# Altium schematic sheet suply_1w.SchDoc
size A4
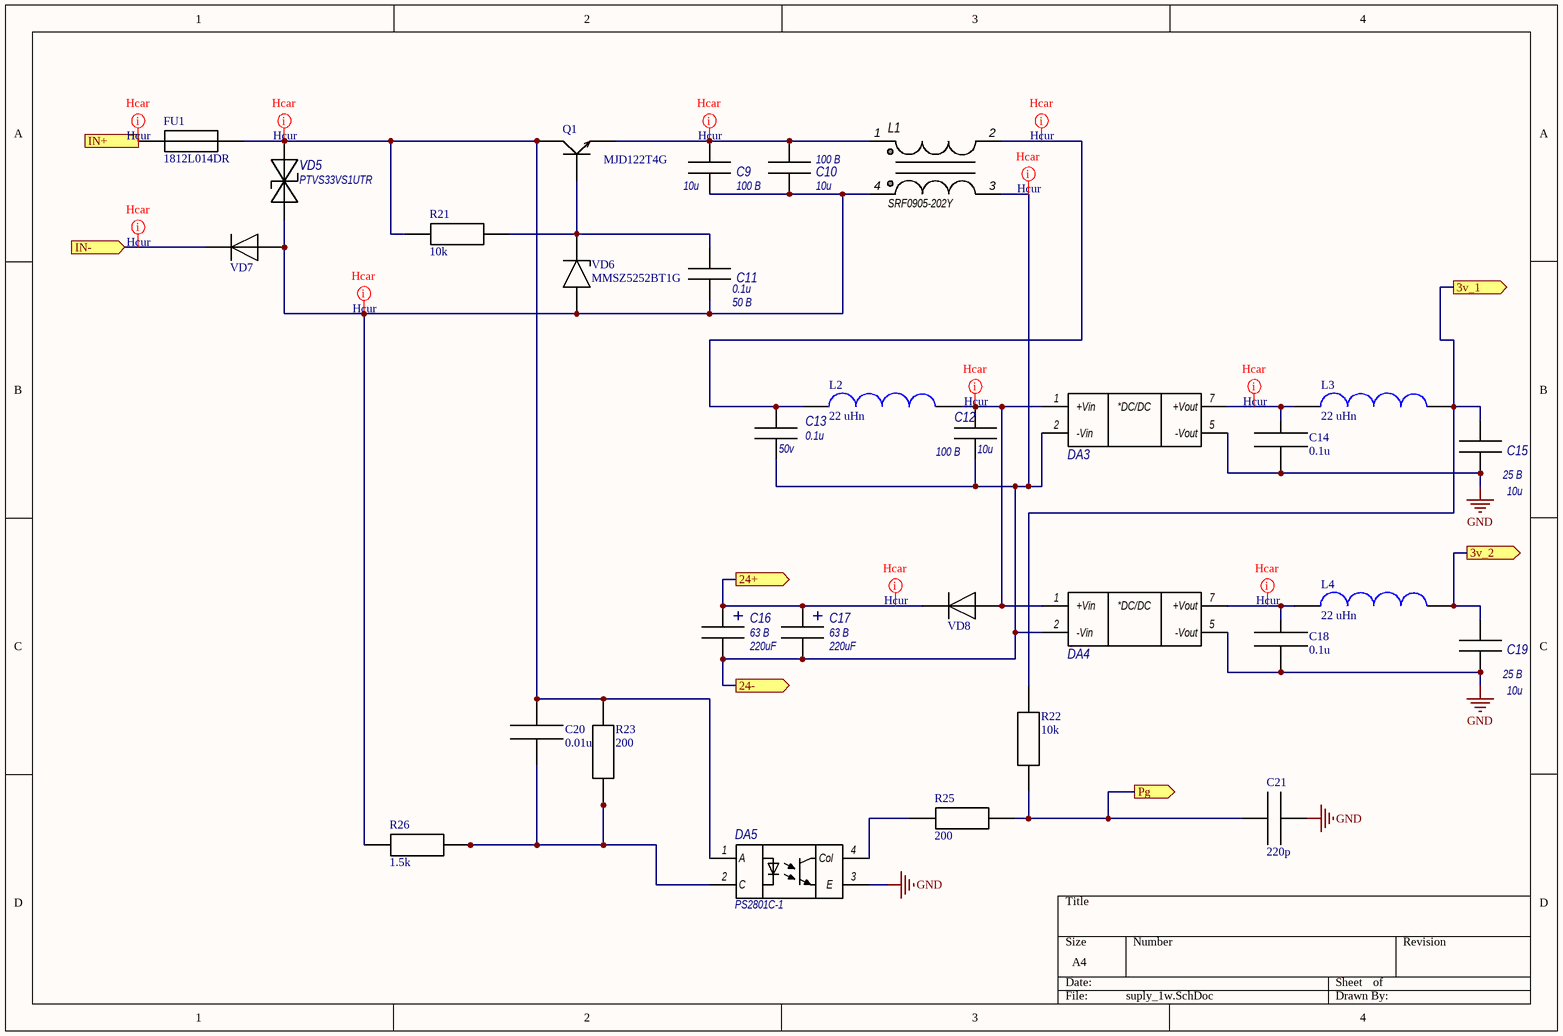
[diagram p0: suply_1w.SchDoc]

## Parts
C9  value 10u  Voltage: 100 В  [C1206_]  (hidden comment: 10u 100v)
C10  value 10u  Voltage: 100 В  [C1206_]  (hidden comment: 10u 100v)
C11  Voltage: 50 В  [C0603]  (hidden comment: 0.1u)
C12  value 10u  Voltage: 100 В  [C1206_]  (hidden comment: 10u 100v)
C13  Voltage: 50v  [C0603]  (hidden comment: 0.1u)
C14  0.1u  [cap_0402]
C15  Voltage: 25 В  [C0603]  (hidden comment: 10u)
C16  value 220uF  Voltage: 63 В  [rad_cap_10х12]  (hidden comment: 220u 63v)
C17  value 220uF  Voltage: 63 В  [rad_cap_10х12]  (hidden comment: 220u 63v)
C18  0.1u  [cap_0402]
C19  Voltage: 25 В  [C0603]  (hidden comment: 10u)
C20  0.01u  [0603_cap]
C21  220p  [cap_0402]
DA3  AM1D-2403SH30Z  [AM1D-2405]  (value not drawn)
DA4  AM1D-2403SH30Z  [AM1D-2405]  (value not drawn)
DA5  PS2801C-1  [SSOP-4N]
FU1  1812L014DR  [fuse1210]
L1  value SRF0905-202Y  [SRF0905]  (hidden comment: SRF0905)
L2  22 uHn  [ifsc1515]
L3  22 uHn  [ifsc1515]
L4  22 uHn  [ifsc1515]
Q1  MJD122T4G  [sot23]
R21  10k  [0603_res]
R22  10k  [res_0402]
R23  200  [0603_res]
R25  200  [res_0402]
R26  1.5k  [2512_res]
VD5  PTVS33VS1UTR  [SOD-123]
VD6  MMSZ5252BT1G  [SOD-123]
VD7  1N4448W  [SOD-123]  (value not drawn)
VD8  1N4448W  [SOD-123]  (value not drawn)

## Ports
3v_1 (out), 3v_2 (out), 24+ (out), 24- (out), IN+ (in), IN- (in), Pg (out)

## Nets
GND: C14.2 C15.1 C18.2 C19.1 C21.1 DA3.5(-Vout) DA4.5(-Vout) DA5.3(E)
3v_1: C15.2 L3.2 R22.2 ; port 3v_1
3v_2: C19.2 L4.2 ; port 3v_2
24+: C16.1(A) C17.1(A) VD8.K ; port 24+
24-: C12.1 C13.1 C16.2(K) C17.2(K) DA3.2(-Vin) DA4.2(-Vin) L1.3 ; port 24-
IN+: FU1.1 ; port IN+
IN-: VD7.K ; port IN-
Pg: C21.2 R22.1 R25.1 ; port Pg
NetC9_1: C9.1 C10.1 C11.1 L1.4 R26.1 VD5.A VD6.A VD7.A
NetC9_2: C9.2 C10.2 L1.1 Q1.3(E)
NetC11_2: C11.2 Q1.1(B) R21.2 VD6.K
NetC12_2: C12.2 DA3.1(+Vin) DA4.1(+Vin) L2.2 VD8.A
NetC13_2: C13.2 L1.2 L2.1
NetC14_1: C14.1 DA3.7(+Vout) L3.1
NetC18_1: C18.1 DA4.7(+Vout) L4.1
NetC20_1: C20.1 DA5.2(C) R23.1 R26.2
NetC20_2: C20.2 DA5.1(A) FU1.2 Q1.2(K) R21.1 R23.2 VD5.K
NetDA5_4: DA5.4(Col) R25.2

## Layout directives
net class Hcur: 24+, 24-, IN+, IN-, NetC9_1, NetC9_2, NetC12_2, NetC13_2, NetC14_1, NetC18_1, NetC20_2

## Notes on the sheet
- (in symbol AM1D-2405SH30Z) *DC/DC
- (in symbol Capacitor electrolytic) +

## Library data of the parts
C9 C10 C12 = Capacitor ceramic: Capacitance: 10u x 100 В; Dielectric: *; Tolerance: *
C11 = Capacitor ceramic: Capacitance: 0.1u x 50 В; Dielectric: *; Tolerance: *; Value: 0.1u
C13 = Capacitor ceramic: Capacitance: 0.1u x 50v; Dielectric: *; Tolerance: *; Value: 0.1u
C14 C18 C20 C21 = cap
C15 C19 = Capacitor ceramic: Capacitance: 10u x 25 В; Dielectric: *; Tolerance: *; Value: 10u
C16 = Capacitor electrolytic: Tolerance: ±20%; Polarization: Polar; Capacitance: 220uF x 63 В; Famile: Capacitor; Category: Capacitors; Operating Temperature: -40°C ~ 105°C; Package / Case: Radial, Can - SMD; ComponentLink1Description: Параметры; ComponentLink1URL: 5\res\Справочники\Конденсаторы\KEM_A4003_EXV.pdf; Dielectric: 63v
C17 = Capacitor electrolytic: 10x12; Tolerance: ±20%; Polarization: Polar; Capacitance: 220uF x 63 В; Famile: Capacitor; Category: Capacitors; Operating Temperature: -40°C ~ 105°C; Package / Case: Radial, Can - SMD; ComponentLink1Description: Параметры; ComponentLink1URL: 5\res\Справочники\Конденсаторы\KEM_A4003_EXV.pdf; Dielectric: 63v
DA3 DA4 = AM1D-2405SH30Z: AM1D-2403SH30Z 21.6-26.4V 3.3V 200mA 3000V 54мА 6мА 220мкF 77%
FU1 = fuse
L2-L4 = ind_b82477g4
Q1 = npn
R21-R23 R25 R26 = res
VD5 = PTVS33VS1UTR: PTVS33VS1UTR,115, TVS DIODE 33VWM 53.3VC SOD123W; Type: PTVS33VS1UTR
VD6 = stab: MMSZ5252BT1G, Стабилитрон 0.5Вт 24В
VD7 VD8 = 1N4448
DA5 = PS2801C-1: Type: PS2801C-1